# Altium project Digital Interface.PrjPcb (part 2 of 2)

## Sheet Audio Codec.SchDoc
size 297 x 209 mm; SheetNumber: 18; SheetTotal: 29
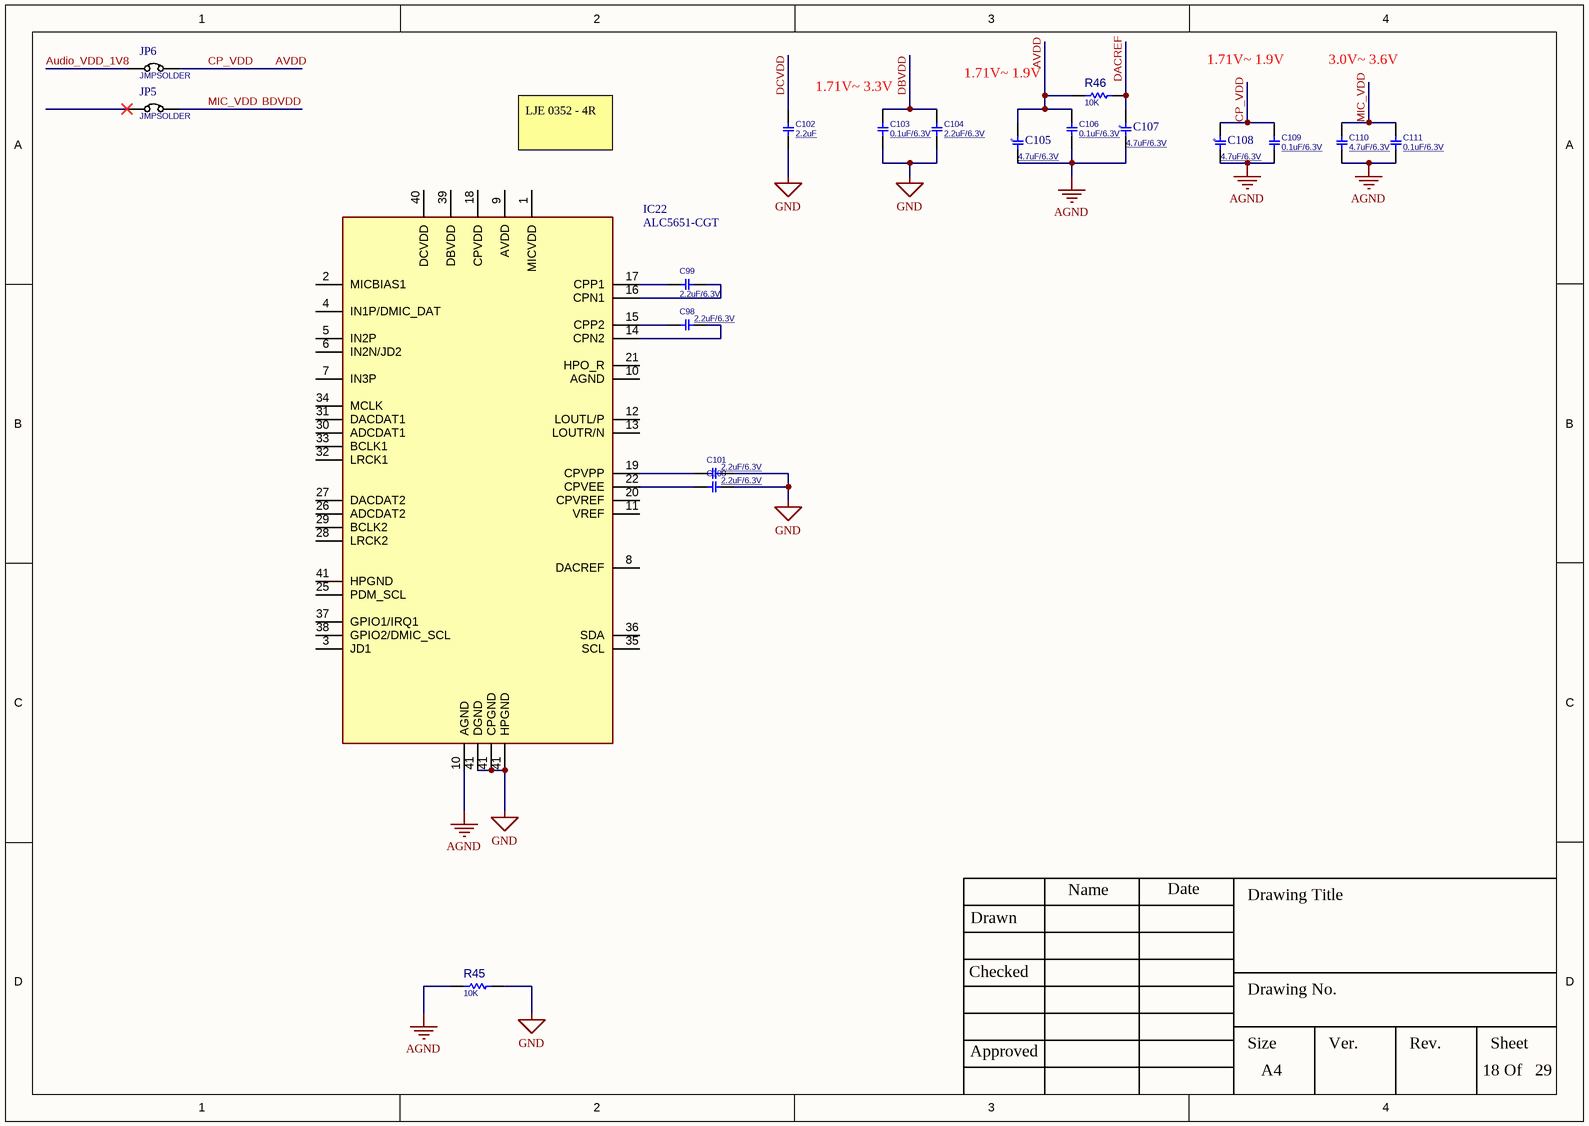
[diagram p15: Audio Codec.SchDoc]

### Parts
C98  2.2uF/6.3V  [C0603]
C99  2.2uF/6.3V  [C0603]
C100  2.2uF/6.3V  [C0603]
C101  2.2uF/6.3V  [C0603]
C102  2.2uF  [C0603]
C103  0.1uF/6.3V  [C0603]
C104  2.2uF/6.3V  [C0603]
C105  value 4.7uF/6.3V  [Cap_A]  (hidden comment: Capacitor Tantalum SMD)
C106  0.1uF/6.3V  [C0603]
C107  value 4.7uF/6.3V  [Cap_A]  (hidden comment: Capacitor Tantalum SMD)
C108  value 4.7uF/6.3V  [Cap_A]  (hidden comment: Capacitor Tantalum SMD)
C109  0.1uF/6.3V  [C0603]
C110  4.7uF/6.3V  [C0805]
C111  0.1uF/6.3V  [C0603]
IC22  ALC5651-CGT  [QFN40P500X500X90-41N-D]
JP5  JMPSOLDER  [JP_40X50]
JP6  JMPSOLDER  [JP_40X50]
R45  10K  [R0603]
R46  10K  [R0603]

### Nets
AGND: C105.1 C106.1 C107.1 C108.1 C109.1 C110.2 C111.2 IC22.10(AGND) R45.1
Audio_VDD_1V8: JP6.1
GND: C100.1 C101.1 C102.1 C103.1 C104.1 IC22.41(HPGND) R45.2
AVDD: C105.2 C106.2 C108.2 C109.2 JP6.2 R46.1  [also labelled CP_VDD]
BDVDD: C110.1 C111.1 JP5.2  [also labelled MIC_VDD]
DACREF: C107.2 R46.2
DBVDD: C103.2 C104.2
DCVDD: C102.2
NetC98_1: C98.1 IC22.14(CPN2)
NetC98_2: C98.2 IC22.15(CPP2)
NetC99_1: C99.1 IC22.17(CPP1)
NetC99_2: C99.2 IC22.16(CPN1)
NetC100_2: C100.2 IC22.22(CPVEE)
NetC101_2: C101.2 IC22.19(CPVPP)

Not connected (* = marked no-connect by the designer): IC22 1(MICVDD) 2(MICBIAS1) 3(JD1) 4(IN1P/DMIC_DAT) 5(IN2P) 6(IN2N/JD2) 7(IN3P) 8(DACREF) 9(AVDD) 11(VREF) 12(LOUTL/P) 13(LOUTR/N) 18(CPVDD) 20(CPVREF) 21(HPO_R) 25(PDM_SCL) 26(ADCDAT2) 27(DACDAT2) 28(LRCK2) 29(BCLK2) 30(ADCDAT1) 31(DACDAT1) 32(LRCK1) 33(BCLK1) 34(MCLK) 35(SCL) 36(SDA) 37(GPIO1/IRQ1) 38(GPIO2/DMIC_SCL) 39(DBVDD) 40(DCVDD); JP5 1*

### Notes on the sheet
- 1.71V~ 1.9V
- 3.0V~ 3.6V
- 1.71V~ 3.3V
- LJE 0352 - 4R
- Drawn
- Name
- Date
- Drawing Title
- Checked
- Drawing No.
- Approved
- Size
- A4
- Ver.
- Rev.
- Sheet
- Of
- (in symbol Capacitor Tantalum SMD) +

### Library data of the parts
C98-C104 C106 C109 C111 = CAP_SMD_MLCC_0603: CAP, MLCC, -F, -V, MATERIAL, -%, 0201; PARAM: -, -%; MANF_P#: MANF_PART#; PRICE: 100= 1$; MANF: -; PARAM2: -V; ASSEMBLY: ASSEMBLY
  C98-C101 C104: VALUE: 2.2uF/6.3V
  C102: VALUE: 2.2uF
  C103 C106 C109 C111: VALUE: 0.1uF/6.3V
C110 = CAP_SMD_MLCC_0805: CAP, MLCC, -F, -V, MATERIAL, -%, 0201; PARAM: -, -%; MANF_P#: MANF_PART#; PRICE: 100= 1$; MANF: -; PARAM2: -V; ASSEMBLY: ASSEMBLY; VALUE: 4.7uF/6.3V
IC22 = ALC5651-CGT: Integrated Circuit; Manufacturer_Name: Realtek; Datasheet Link: https://datasheet.lcsc.com/szlcsc/2001151131_Realtek-Semicon-ALC5651-CGT_C474323.pdf; Height: 0.9mm; Manufacturer_Part_Number: ALC5651-CGT
JP5 JP6 = JUMPER_SOLDER: JUMPER, HEADER 2PIN; MANF: MANF; MANF_P#: MANF_P#; VALUE: JMPSOLDER
R45 R46 = RES_SMD_0603: as R5 on sheet AUX Power; MANF_P#: -; MANF: -; ASSEMBLY: ASSEMBLY; PRICE: 100= 0.5$; VALUE: 10K
C105 C107 C108 = Capacitor Tantalum SMD: DatasheetVersion: 2021; ComponentLink1Description: Website Smart World; ComponentLink1URL: https://www.smartw.ir/; ComponentLink2Description: Telegram; ComponentLink2URL: https://t.me/altium_smartw; ComponentLink3Description: Instagram; ComponentLink3URL: https://Instagram.com/smartgw.ir

## Sheet SD CARD .SchDoc
size 297 x 209 mm; SheetNumber: 19; SheetTotal: 29
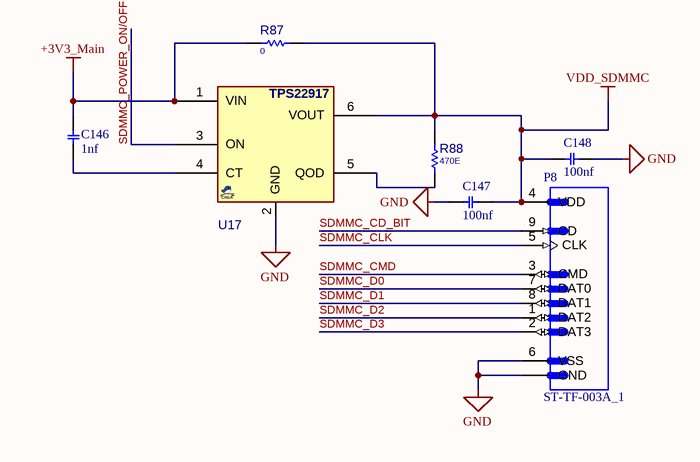
[diagram p16: SD CARD .SchDoc]

### Parts
C146  value 1nf  [C0603]  (hidden comment: Capacitor C SMD 0603)
C147  value 100nf  [C0603]  (hidden comment: Capacitor C SMD 0603)
C148  value 100nf  [C0603]  (hidden comment: Capacitor C SMD 0603)
P8  ST-TF-003A_1  [SUNTECH_ST-TF-003A]
R87  0  [R0603]
R88  470E  [R0603]
U17  TPS22917  [SOT23_6]  (value not drawn)

### Nets
+3V3_Main: C146.2 R87.1 U17.1(VIN)  [project net Audio_VDD_3V3]
GND: C147.2 C148.1 P8.6(VSS) P8.G1(GND) U17.2(GND)
VDD_SDMMC: C147.1 C148.2 P8.4(VDD) R87.2 R88.2 U17.6(VOUT)
SDMMC_CD_BIT: P8.9(CD)
SDMMC_CLK: P8.5(CLK)
SDMMC_CMD: P8.3(CMD)
SDMMC_D0: P8.7(DAT0)
SDMMC_D1: P8.8(DAT1)
SDMMC_D2: P8.1(DAT2)
SDMMC_D3: P8.2(DAT3)
SDMMC_POWER_ON/OFF: U17.3(ON)
NetC146_1: C146.1 U17.4(CT)
NetR88_1: R88.1 U17.5(QOD)

### Notes on the sheet
- Drawn
- Name
- Date
- Drawing Title
- Checked
- Drawing No.
- Approved
- Size
- A4
- Ver.
- Rev.
- Sheet
- Of

### Library data of the parts
P8 = ST-TF-003A_1: Micro SD Card Socket; Price: None; MP: ST-TF-003A; Availability: Unavailable; Value: *; Package: None
R87 R88 = RES_SMD_0603: as R5 on sheet AUX Power; MANF_P#: -; MANF: -; ASSEMBLY: ASSEMBLY; PRICE: 100= 0.5$
  R87: VALUE: 0
  R88: VALUE: 470E
U17 = TPS22917_SOT23: LOAD SW, 2A, 1~5.5v, 80mOhm, SOT23; MANF: TI; MANF_P#: TPS22917DBV; PARAM: 2A, 1~5.5v, 80mOhm, -40~105oC; PRICE: 0.5$; VALUE: TPS22917
C146-C148 = Capacitor C SMD 0603: DatasheetVersion: 2021; ComponentLink1Description: Website Smart World; ComponentLink1URL: https://www.smartw.ir/; ComponentLink2Description: Telegram; ComponentLink2URL: https://t.me/altium_smartw; ComponentLink3Description: Instagram; ComponentLink3URL: https://Instagram.com/smartgw.ir

## Sheet MCU GPIO.SchDoc
size 297 x 209 mm; SheetNumber: 20; SheetTotal: 29
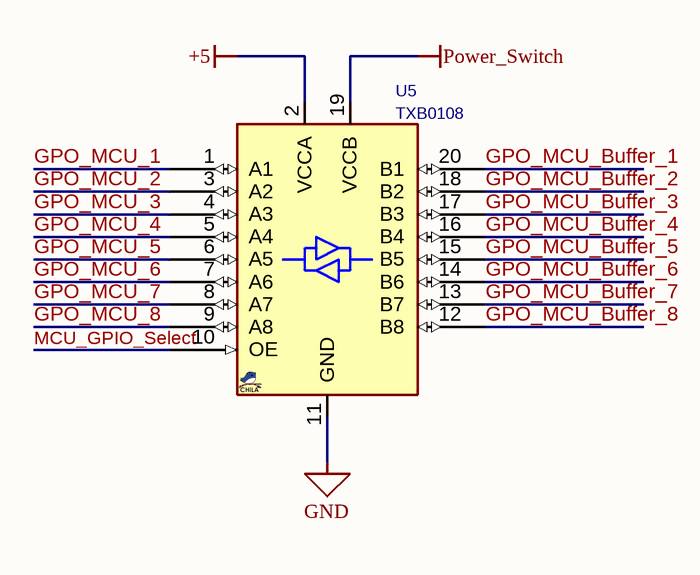
[diagram p17: MCU GPIO.SchDoc]

### Parts
U5  TXB0108  [SOG65_20]

### Nets
+5: U5.2(VCCA)  [project net Current_Measurement_1_in-]
GND: U5.11(GND)
Power_Switch: U5.19(VCCB)
GPO_MCU_1: U5.1(A1)
GPO_MCU_2: U5.3(A2)
GPO_MCU_3: U5.4(A3)
GPO_MCU_4: U5.5(A4)
GPO_MCU_5: U5.6(A5)
GPO_MCU_6: U5.7(A6)
GPO_MCU_7: U5.8(A7)
GPO_MCU_8: U5.9(A8)
GPO_MCU_Buffer_1: U5.20(B1)
GPO_MCU_Buffer_2: U5.18(B2)
GPO_MCU_Buffer_3: U5.17(B3)
GPO_MCU_Buffer_4: U5.16(B4)
GPO_MCU_Buffer_5: U5.15(B5)
GPO_MCU_Buffer_6: U5.14(B6)
GPO_MCU_Buffer_7: U5.13(B7)
GPO_MCU_Buffer_8: U5.12(B8)
MCU_GPIO_Select: U5.10(OE)

### Notes on the sheet
- Drawn
- Name
- Date
- Drawing Title
- Checked
- Drawing No.
- Approved
- Size
- A4
- Ver.
- Rev.
- Sheet
- Of

### Library data of the parts
U5 = TXB0108_TSSOP20: Buffer, VOLTAGE-LEVEL TRANSLATOR, 8-BIT, BIDIRECTIONAL, AUTO-DIRECTION SENSING; MANF: Texas Instruments; DESC: 50mA; MANF_P#: TXB0108PWR; PARAM2: 1.2~3.6VCCA, 1.65~5.5V VCCB (VCCA <= VCCB); PARAM: 8-BIT, BIDIRECTIONAL, AUTO-DIRECTION SENSING; VALUE: TXB0108

## Sheet MCU Sup.SchDoc
size 297 x 209 mm; SheetNumber: 21; SheetTotal: 29
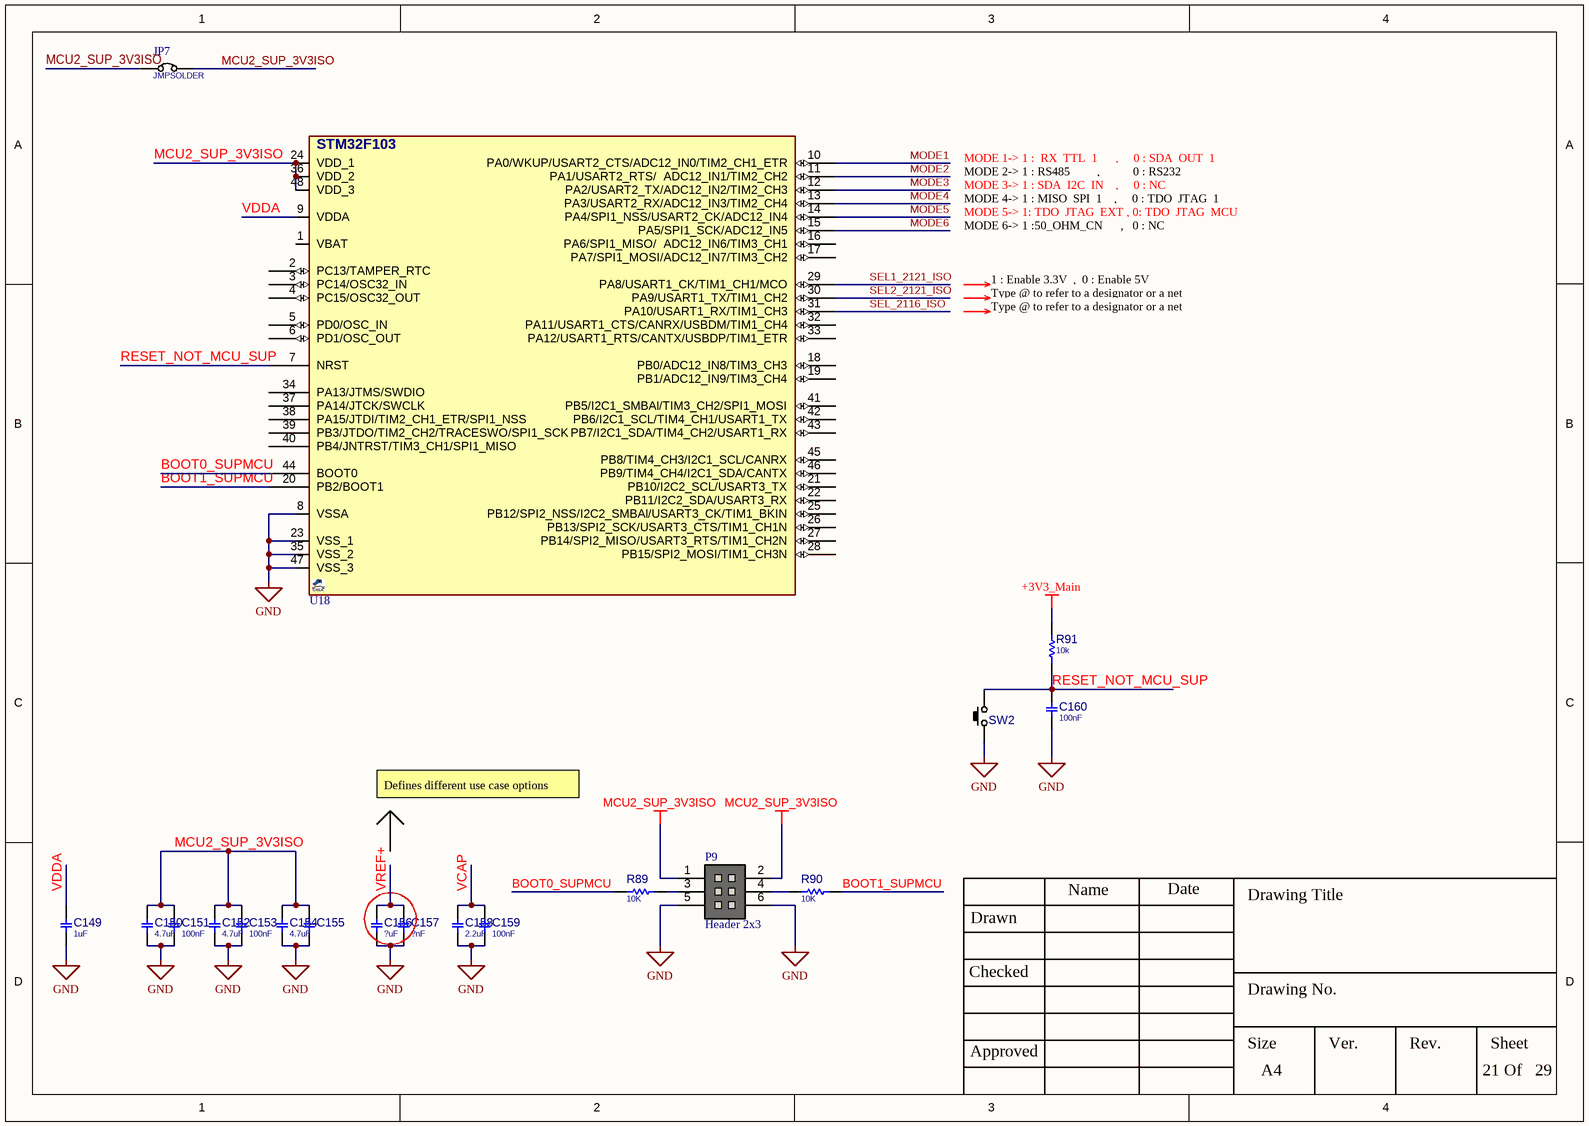
[diagram p18: MCU Sup.SchDoc]

### Parts
C149  1uF  [C0805]
C150  4.7uF  [C0805]
C151  100nF  [C0603]
C152  4.7uF  [C0805]
C153  100nF  [C0603]
C154  4.7uF  [C0805]
C155  (no value)  [C0603]
C156  ?uF  [C0805]
C157  ?nF  [C0603]
C158  2.2uF  [C0805]
C159  100nF  [C0603]
C160  100nF  [C0603]
JP7  JMPSOLDER  [JP_40X50]
P9  Header 2x3  [HDR 2X3]
R89  10K  [R0603]
R90  10K  [R0603]
R91  10k  [R0603]
SW2  PUSHBUTTON  [SWPBS_SPST_6X3X5]  (value not drawn)
U18  STM32F103  [QFG50_48]  (value not drawn)

### Nets
+3V3_Main: R91.2  [project net Audio_VDD_3V3]
GND: C149.2 C150.2 C151.2 C152.2 C153.2 C154.2 C155.2 C156.2 C157.2 C158.2 C159.2 C160.2 P9.5 P9.6 SW2.1(P1) U18.8(VSSA) U18.23(VSS_1) U18.35(VSS_2) U18.47(VSS_3)
MCU2_SUP_3V3ISO: C150.1 C151.1 C152.1 C153.1 C154.1 C155.1 JP7.1 JP7.2 P9.1 P9.2 U18.24(VDD_1) U18.36(VDD_2) U18.48(VDD_3)
BOOT0_SUPMCU: R89.1 U18.44(BOOT0)
BOOT1_SUPMCU: R90.2 U18.20(PB2/BOOT1)
MODE1: U18.10(PA0/WKUP/USART2_CTS/ADC12_IN0/TIM2_CH1_ETR)
MODE2: U18.11(PA1/USART2_RTS/__ADC12_IN1/TIM2_CH2)
MODE3: U18.12(PA2/USART2_TX/ADC12_IN2/TIM2_CH3)
MODE4: U18.13(PA3/USART2_RX/ADC12_IN3/TIM2_CH4)
MODE5: U18.14(PA4/SPI1_NSS/USART2_CK/ADC12_IN4)
MODE6: U18.15(PA5/SPI1_SCK/ADC12_IN5)
RESET_NOT_MCU_SUP: C160.1 R91.1 SW2.2(P3) U18.7(NRST)
SEL1_2121_ISO: U18.29(PA8/USART1_CK/TIM1_CH1/MCO)
SEL2_2121_ISO: U18.30(PA9/USART1_TX/TIM1_CH2)
SEL_2116_ISO: U18.31(PA10/USART1_RX/TIM1_CH3)
VCAP: C158.1 C159.1
VDDA: C149.1 U18.9(VDDA)
VREF+: C156.1 C157.1
NetP9_3: P9.3 R89.2
NetP9_4: P9.4 R90.1

Not connected (* = marked no-connect by the designer): U18 1(VBAT) 2(PC13/TAMPER_RTC) 3(PC14/OSC32_IN) 4(PC15/OSC32_OUT) 5(PD0/OSC_IN) 6(PD1/OSC_OUT) 16(PA6/SPI1_MISO/__ADC12_IN6/TIM3_CH1) 17(PA7/SPI1_MOSI/ADC12_IN7/TIM3_CH2) 18(PB0/ADC12_IN8/TIM3_CH3) 19(PB1/ADC12_IN9/TIM3_CH4) 21(PB10/I2C2_SCL/USART3_TX) 22(PB11/I2C2_SDA/USART3_RX) 25(PB12/SPI2_NSS/I2C2_SMBAl/USART3_CK/TIM1_BKIN) 26(PB13/SPI2_SCK/USART3_CTS/TIM1_CH1N) 27(PB14/SPI2_MISO/USART3_RTS/TIM1_CH2N) 28(PB15/SPI2_MOSI/TIM1_CH3N) 32(PA11/USART1_CTS/CANRX/USBDM/TIM1_CH4) 33(PA12/USART1_RTS/CANTX/USBDP/TIM1_ETR) 34(PA13/JTMS/SWDIO) 37(PA14/JTCK/SWCLK) 38(PA15/JTDI/TIM2_CH1_ETR/SPI1_NSS) 39(PB3/JTDO/TIM2_CH2/TRACESWO/SPI1_SCK) 40(PB4/JNTRST/TIM3_CH1/SPI1_MISO) 41(PB5/I2C1_SMBAl/TIM3_CH2/SPI1_MOSI) 42(PB6/I2C1_SCL/TIM4_CH1/USART1_TX) 43(PB7/I2C1_SDA/TIM4_CH2/USART1_RX) 45(PB8/TIM4_CH3/I2C1_SCL/CANRX) 46(PB9/TIM4_CH4/I2C1_SDA/CANTX)

### Notes on the sheet
- MODE 1-> 1 :  RX_TTL_1      ,     0 : SDA_OUT_1
- MODE 2-> 1 : RS485         ,           0 : RS232
- MODE 3-> 1 : SDA_I2C_IN    ,     0 : NC
- MODE 4-> 1 : MISO_SPI_1    ,     0 : TDO_JTAG_1
- MODE 5-> 1: TDO_JTAG_EXT , 0: TDO_JTAG_MCU
- MODE 6-> 1 :50_OHM_CN      ,   0 : NC
- 1 : Enable 3.3V  ,  0 : Enable 5V
- Type @ to refer to a designator or a net
- Defines different use case options
- Drawn
- Name
- Date
- Drawing Title
- Checked
- Drawing No.
- Approved
- Size
- A4
- Ver.
- Rev.
- Sheet
- Of

### Library data of the parts
C149 C150 C152 C154 C156 C158 = CAP_SMD_MLCC_2.2u50V_0805: CAP, MLCC; MANF_P#: UMK212ABJ225KG-T; MANF: Taiyo Yuden; PARAM: X5R, 10%; DIST#: MOUSER; PARAM2: 50V; ASSEMBLY: ASSEMBLY; PRICE: 100= 10$; DESC: CAP, MLCC
  C149: VALUE: 1uF
  C150 C152 C154: VALUE: 4.7uF
  C156: VALUE: ?uF
  C158: VALUE: 2.2uF
C151 C153 C155 C157 C159 C160 = CAP_SMD_MLCC_2.2u50V_0603: CAP, MLCC; MANF_P#: C1005X7R1H104K050BB; MANF: TDK; PARAM: X7R, 10%; DIST#: MOUSER; PARAM2: 50V; ASSEMBLY: ASSEMBLY; PRICE: 1000= 27$; DESC: CAP, MLCC
  C151 C153 C159 C160: VALUE: 100nF
  C157: VALUE: ?nF
JP7 = JUMPER_SOLDER: JUMPER, HEADER 2PIN; MANF: MANF; MANF_P#: MANF_P#; VALUE: JMPSOLDER
R89 R90 = RES_SMD: RESISTOR, SMD; PARAM: -W; DESC: DESCRIPTION; DIST#: MOUSER; PARAM2: 1%; MANF_P#: -; MANF: -; ASSEMBLY: ASSEMBLY; PRICE: 100= 0.5$; VALUE: 10K
R91 = RES_SMD_0603: as R5 on sheet AUX Power; MANF_P#: -; MANF: -; ASSEMBLY: ASSEMBLY; PRICE: 100= 0.5$; VALUE: 10k
SW2 = SWPBS_SPST_6X3X5: SWITCH, PUSH BUTTON, TACTILE, SMD, SPST, 6X3.5X5mm; MANF: ALPS; DESC: DESCRIPTION; MANF_P#: SKQMBBE010; VALUE: PUSHBUTTON; ASSEMBLY: ASSEMBLY; PARAM: PARAM; PRICE: PRICE
U18 = STM32F103C8T6_QFP48: MCU, STM32 ARM 32-bit, Cortex M3, 64KB FLASH, 20KB SRAM; DESC: CAN, I2C, SPI, USART, USB; MANF: ST; PARAM2: 2~3.6VCC, 72MHz, 2X12Bit ADC; PARAM: 64KB FLASH, 20KB SRAM, -40~85oC; MANF_P#: STM32F103C8T6; PRICE: 6$; VALUE: STM32F103
P9 = Header 2x3: ComponentLinkp-URL: https://www.smartw.ir/; DatasheetVersion: 2020

## Sheet Sync In.SchDoc
size 297 x 209 mm; SheetNumber: 22; SheetTotal: 29
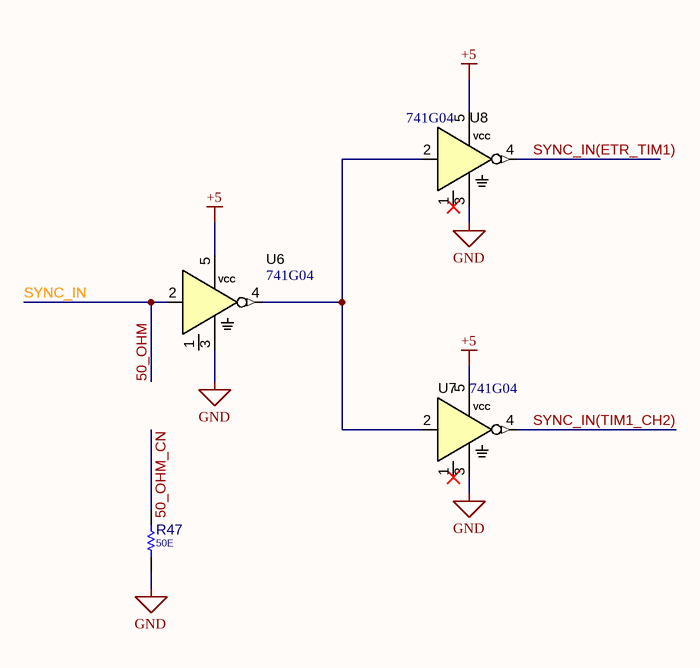
[diagram p19: Sync In.SchDoc]

### Parts
R47  50E  [R0603]
U6  741G04  [SOT353_5]
U7  741G04  [SOT353_5]
U8  741G04  [SOT353_5]

### Nets
+5: U6.5(VCC) U7.5(VCC) U8.5(VCC)  [project net Current_Measurement_1_in-]
GND: R47.2 U6.3(GND) U7.3(GND) U8.3(GND)
50_OHM: U6.2(A)  [also labelled SYNC_IN]
50_OHM_CN: R47.1
SYNC_IN(ETR_TIM1): U8.4(Y)
SYNC_IN(TIM1_CH2): U7.4(Y)
NetU6_4: U6.4(Y) U7.2(A) U8.2(A)

Not connected (* = marked no-connect by the designer): U6 1(NC); U7 1(NC)*; U8 1(NC)*

### Notes on the sheet
- Drawn
- Name
- Date
- Drawing Title
- Checked
- Drawing No.
- Approved
- Size
- A4
- Ver.
- Rev.
- Sheet
- Of

### Library data of the parts
R47 = RES_SMD_0603: as R5 on sheet AUX Power; MANF_P#: -; MANF: -; ASSEMBLY: ASSEMBLY; PRICE: 100= 0.5$; VALUE: 50E
U6-U8 = NOT_SN74LVC1G04_SOT353: GATE, NOT, SINGLE, SOT353 SMD; MANF: Texas Instruments; MANF_P#: SN74LVC1GU04DCK; PARAM2: 2~5.5V; VALUE: 741G04

## Sheet Sync Out.SchDoc
size 297 x 209 mm; SheetNumber: 23; SheetTotal: 29
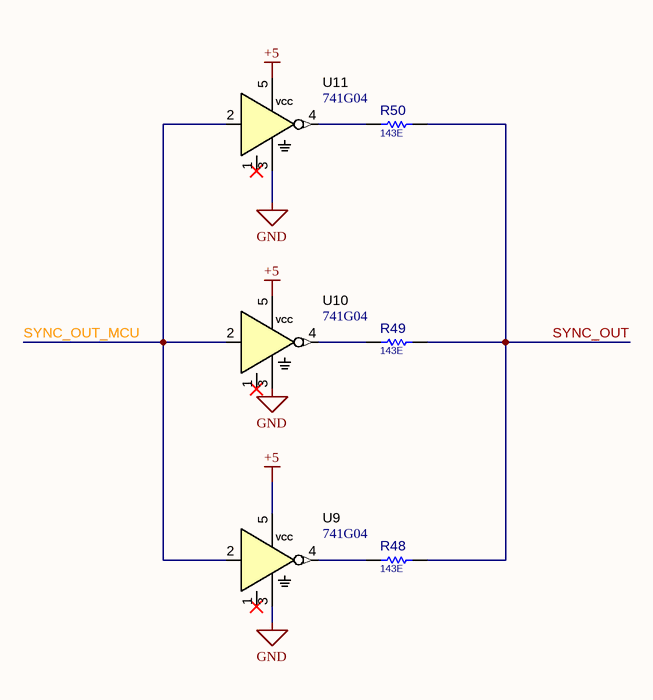
[diagram p20: Sync Out.SchDoc]

### Parts
R48  143E  [R0603]
R49  143E  [R0603]
R50  143E  [R0603]
U9  741G04  [SOT353_5]
U10  741G04  [SOT353_5]
U11  741G04  [SOT353_5]

### Nets
+5: U9.5(VCC) U10.5(VCC) U11.5(VCC)  [project net Current_Measurement_1_in-]
GND: U9.3(GND) U10.3(GND) U11.3(GND)
SYNC_OUT: R48.2 R49.2 R50.2
SYNC_OUT_MCU: U9.2(A) U10.2(A) U11.2(A)
NetR48_1: R48.1 U9.4(Y)
NetR49_1: R49.1 U10.4(Y)
NetR50_1: R50.1 U11.4(Y)

Not connected (* = marked no-connect by the designer): U9 1(NC)*; U10 1(NC)*; U11 1(NC)*

### Notes on the sheet
- Drawn
- Name
- Date
- Drawing Title
- Checked
- Drawing No.
- Approved
- Size
- A4
- Ver.
- Rev.
- Sheet
- Of

### Library data of the parts
R48-R50 = RES_SMD_0603: as R5 on sheet AUX Power; MANF_P#: -; MANF: -; ASSEMBLY: ASSEMBLY; PRICE: 100= 0.5$; VALUE: 143E
U9-U11 = NOT_SN74LVC1G04_SOT353: as U6 on sheet Sync In; VALUE: 741G04

## Sheet Iso Power Protection.SchDoc
size 297 x 209 mm; SheetNumber: 26; SheetTotal: 32

### Notes on the sheet
- Drawn
- Name
- Date
- Drawing Title
- Checked
- Drawing No.
- Approved
- Size
- A4
- Ver.
- Rev.
- Sheet
- Of

## Sheet FT2232HL_IN.SchDoc
size 297 x 209 mm; SheetNumber: 25; SheetTotal: 29
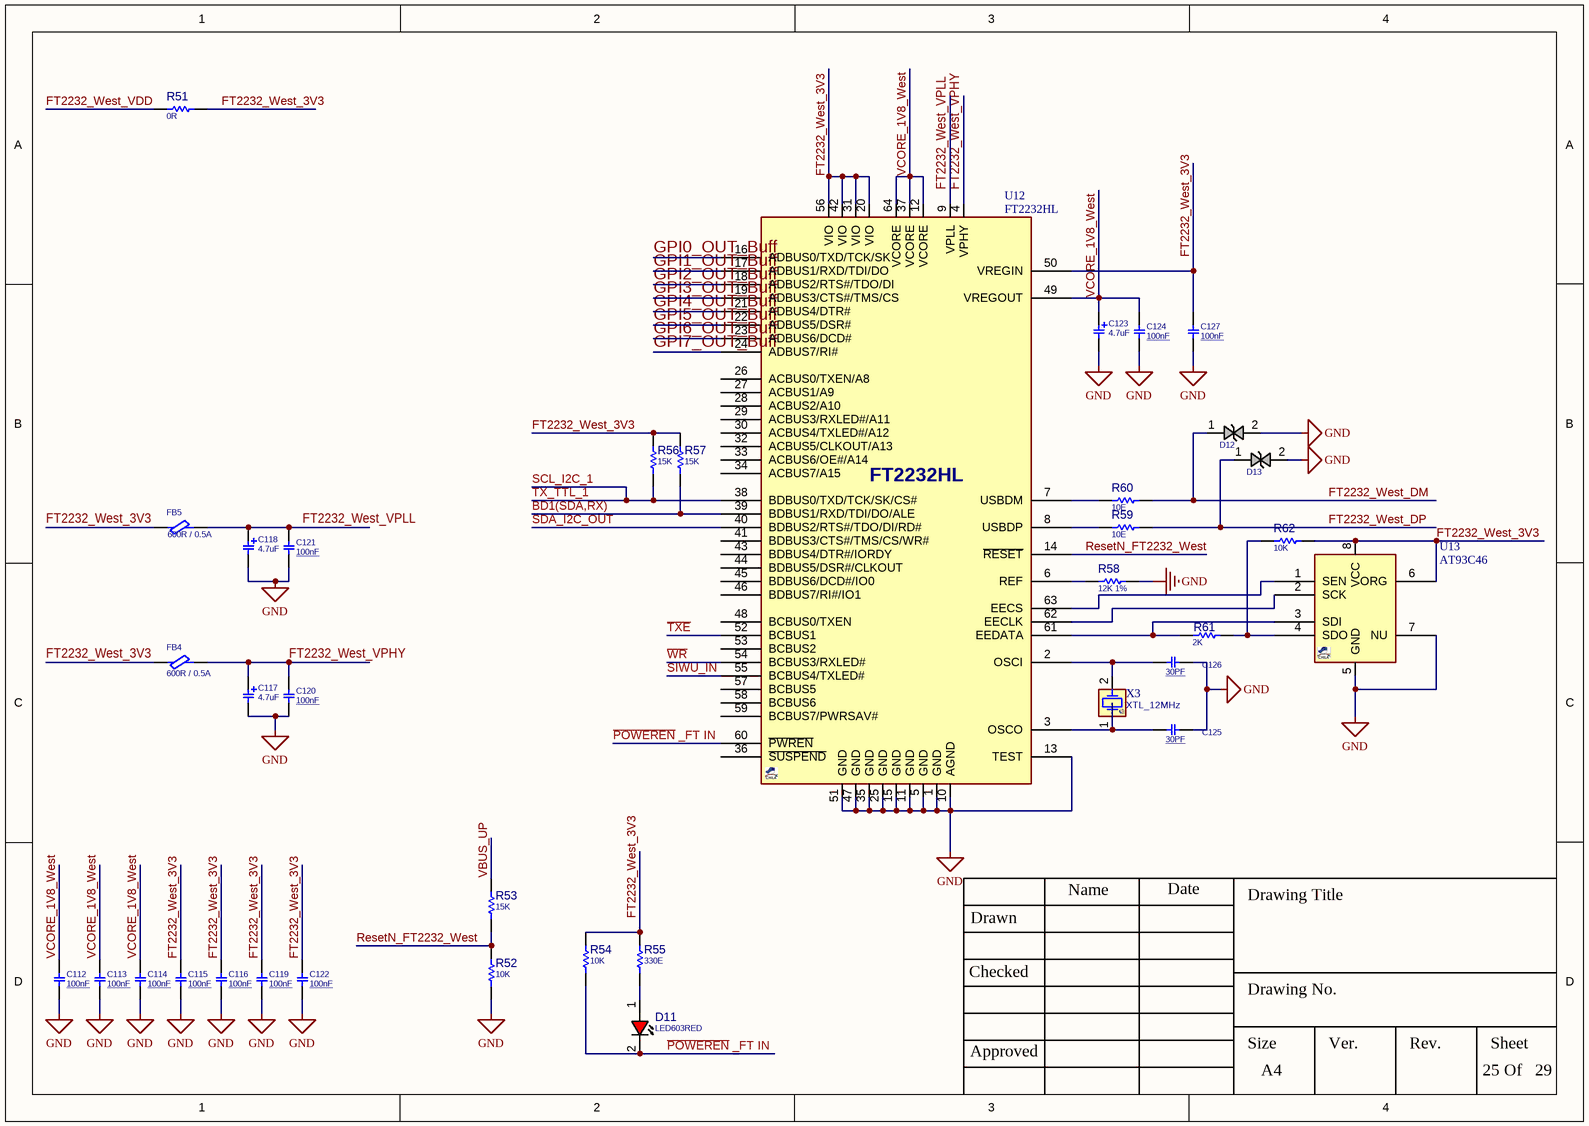
[diagram p21: FT2232HL_IN.SchDoc]

### Parts
C112  100nF  [0603]
C113  100nF  [0603]
C114  100nF  [0603]
C115  100nF  [0603]
C116  100nF  [0603]
C117  4.7uF  [C_TN_3216]
C118  4.7uF  [C_TN_3216]
C119  100nF  [0603]
C120  100nF  [0603]
C121  100nF  [0603]
C122  100nF  [0603]
C123  4.7uF  [C_TN_3216]
C124  100nF  [0603]
C125  30PF  [C0805]
C126  30PF  [C0805]
C127  100nF  [0603]
D11  LED603RED  [LED0603RED]
D12  TVS603  [D0603]  (value not drawn)
D13  TVS603  [D0603]  (value not drawn)
FB4  600R / 0.5A  [L0603]
FB5  600R / 0.5A  [L0603]
R51  0R  [R0603]
R52  10K  [R0603]
R53  15K  [R0603]
R54  10K  [R0603]
R55  330E  [R0603]
R56  15K  [R0603]
R57  15K  [R0603]
R58  value 12K 1%  [R025W_AX04]  (hidden comment: 12K)
R59  10E  [R0603]
R60  10E  [R0603]
R61  value 2K  [R025W_AX04]  (hidden comment: 12K)
R62  value 10K  [R025W_AX04]  (hidden comment: 12K)
U12  FT2232HL  [QFG50_64]
U13  AT93C46  [SO_8]
X3  XTL_12MHz  [XTL_2_11X5]

### Nets
FT2232_West_VDD: R51.1  [project net Audio_VDD_3V3]
GND: C112.2 C113.2 C114.2 C115.2 C116.2 C117.2 C118.2 C119.2 C120.2 C121.2 C122.2 C123.2 C124.2 C125.2 C126.2 C127.2 D12.2 D13.2 R52.2 R58.1 U12.1(GND) U12.5(GND) U12.10(AGND) U12.11(GND) U12.13(TEST) U12.15(GND) U12.25(GND) U12.35(GND) U12.47(GND) U12.51(GND) U13.5(GND) U13.7(NU)
~{POWEREN} _FT IN: D11.2(CATHODE) R54.2 U12.60(~{PWREN})
BD1(SDA,RX): R57.2 U12.39(BDBUS1/RXD/TDI/DO/ALE)
FT2232_West_3V3: C115.1 C116.1 C119.1 C122.1 C127.1 FB4.1 FB5.1 R51.2 R54.1 R55.1 R56.1 R57.1 R62.1 U12.20(VIO) U12.31(VIO) U12.42(VIO) U12.50(VREGIN) U12.56(VIO) U13.6(ORG) U13.8(VCC)
FT2232_West_DM: D12.1 R60.1
FT2232_West_DP: D13.1 R59.1
FT2232_West_VPHY: C117.1 C120.1 FB4.2 U12.4(VPHY)
FT2232_West_VPLL: C118.1 C121.1 FB5.2 U12.9(VPLL)
GPI0_OUT_Buff: U12.16(ADBUS0/TXD/TCK/SK)
GPI1_OUT_Buff: U12.17(ADBUS1/RXD/TDI/DO)
GPI2_OUT_Buff: U12.18(ADBUS2/RTS#/TDO/DI)
GPI3_OUT_Buff: U12.19(ADBUS3/CTS#/TMS/CS)
GPI4_OUT_Buff: U12.21(ADBUS4/DTR#)
GPI5_OUT_Buff: U12.22(ADBUS5/DSR#)
GPI6_OUT_Buff: U12.23(ADBUS6/DCD#)
GPI7_OUT_Buff: U12.24(ADBUS7/RI#)
ResetN_FT2232_West: R52.1 R53.2 U12.14(~{RESET})
SCL_I2C_1: R56.2 U12.38(BDBUS0/TXD/TCK/SK/CS#)  [also labelled TX_TTL_1]
SDA_I2C_OUT: U12.40(BDBUS2/RTS#/TDO/DI/RD#)
SIWU_IN: U12.55(BCBUS4/TXLED#)
~{TXE}: U12.52(BCBUS1)
VBUS_UP: R53.1
VCORE_1V8_West: C112.1 C113.1 C114.1 C123.1 C124.1 U12.12(VCORE) U12.37(VCORE) U12.49(VREGOUT) U12.64(VCORE)
~{WR}: U12.54(BCBUS3/RXLED#)
NetC125_1: C125.1 U12.3(OSCO) X3.1(OSC1)
NetC126_1: C126.1 U12.2(OSCI) X3.2(OSC2)
NetD11_1: D11.1(ANODE) R55.2
NetR58_2: R58.2 U12.6(REF)
NetR59_2: R59.2 U12.8(USBDP)
NetR60_2: R60.2 U12.7(USBDM)
NetR61_1: R61.1 R62.2 U13.4(SDO)
NetR61_2: R61.2 U12.61(EEDATA) U13.3(SDI)
NetU12_62: U12.62(EECLK) U13.2(SCK)
NetU12_63: U12.63(EECS) U13.1(SEN)

Not connected (* = marked no-connect by the designer): U12 26(ACBUS0/TXEN/A8) 27(ACBUS1/A9) 28(ACBUS2/A10) 29(ACBUS3/RXLED#/A11) 30(ACBUS4/TXLED#/A12) 32(ACBUS5/CLKOUT/A13) 33(ACBUS6/OE#/A14) 34(ACBUS7/A15) 36(~{SUSPEND}) 41(BDBUS3/CTS#/TMS/CS/WR#) 43(BDBUS4/DTR#/IORDY) 44(BDBUS5/DSR#/CLKOUT) 45(BDBUS6/DCD#/IO0) 46(BDBUS7/RI#/IO1) 48(BCBUS0/TXEN) 53(BCBUS2) 57(BCBUS5) 58(BCBUS6) 59(BCBUS7/PWRSAV#)

### Notes on the sheet
- Drawn
- Name
- Date
- Drawing Title
- Checked
- Drawing No.
- Approved
- Size
- A4
- Ver.
- Rev.
- Sheet
- Of

### Library data of the parts
C112-C116 C119-C122 C124 C127 = CAP_SMD_FILM_1u16v_1210: as C19 on sheet AUX Power; PRICE: 100= 36$; DESC: -; PARAM2: 16V; ASSEMBLY: ASSEMBLY; VALUE: 100nF
C117 C118 C123 = CAP_SMD_TAN_10uF_6.3V: as C76 on sheet RS232; PRICE: 0.46$; VALUE: 4.7uF
C125 C126 = CAP_SMD_MLCC: as C66 on sheet USB HUB; PARAM: C0G, 10%; PRICE: 100= 1.4$; DESC: -; MANF_P#: -; PARAM2: 50V; ASSEMBLY: ASSEMBLY; VALUE: 30PF
D11 = LED_SMD_0603_RED: as D9 on sheet AUX Power; MANF: MANF; ASSEMBLY: ASSEMBLY; PRICE: PRICE; VALUE: LED603RED
D12 D13 = TVS_PGB0010603MR: TVS, ESD PROTECT, 24VDC, Bidirectional; MANF: LittelFuse; MANF_P#: PGB0010603MR; VALUE: TVS603
FB4 FB5 = FBEAD_SMD_MPZ1608S102: FERRITE_Bead, 0603, 0.8A, 300mOhm, 1000@100MHz; MANF: TDK; MANF_P#: MPZ1608S102ATA00; PARAM: 1000@100MHz; PARAM2: 0.8A; PRICE: 100= 3.4$; VALUE: 600R / 0.5A
R51-R57 R59 R60 = RES_SMD_0603: as R5 on sheet AUX Power; MANF_P#: -; MANF: -; ASSEMBLY: ASSEMBLY; PRICE: 100= 0.5$
  R51: VALUE: 0R
  R52 R54: VALUE: 10K
  R53 R56 R57: VALUE: 15K
  R55: VALUE: 330E
  R59 R60: VALUE: 10E
R58 R61 R62 = RES_THD: RESISTOR, THD; MANF_P#: RK73H1ETTP4701F; MANF: KOA SPEER; PARAM: 0.063W; DESC: DESCRIPTION; DIST#: MOUSER; PARAM2: 1%; ASSEMBLY: ASSEMBLY; PRICE: 100= 0.5$
U12 = FT2232HL_QFP64: USB, DUAL, Multipurpose UART/FIFO, USB High Speed; MANF: FTDI; PARAM2: 3.3V; MANF_P#: FT2232HL; VALUE: FT2232HL
U13 = EEPROM_SPI_AT93C46_SOP8: EEPROM, SPI, 1KBIT, SOP-8; VALUE: AT93C46
X3 = XTL_2_HC49_8MHz_SMD: as X2 on sheet USB HUB; PRICE: 0.3$; VALUE: XTL_12MHz

## Sheet FT2232HL_OUT.SchDoc
size 297 x 209 mm; SheetNumber: 26; SheetTotal: 29
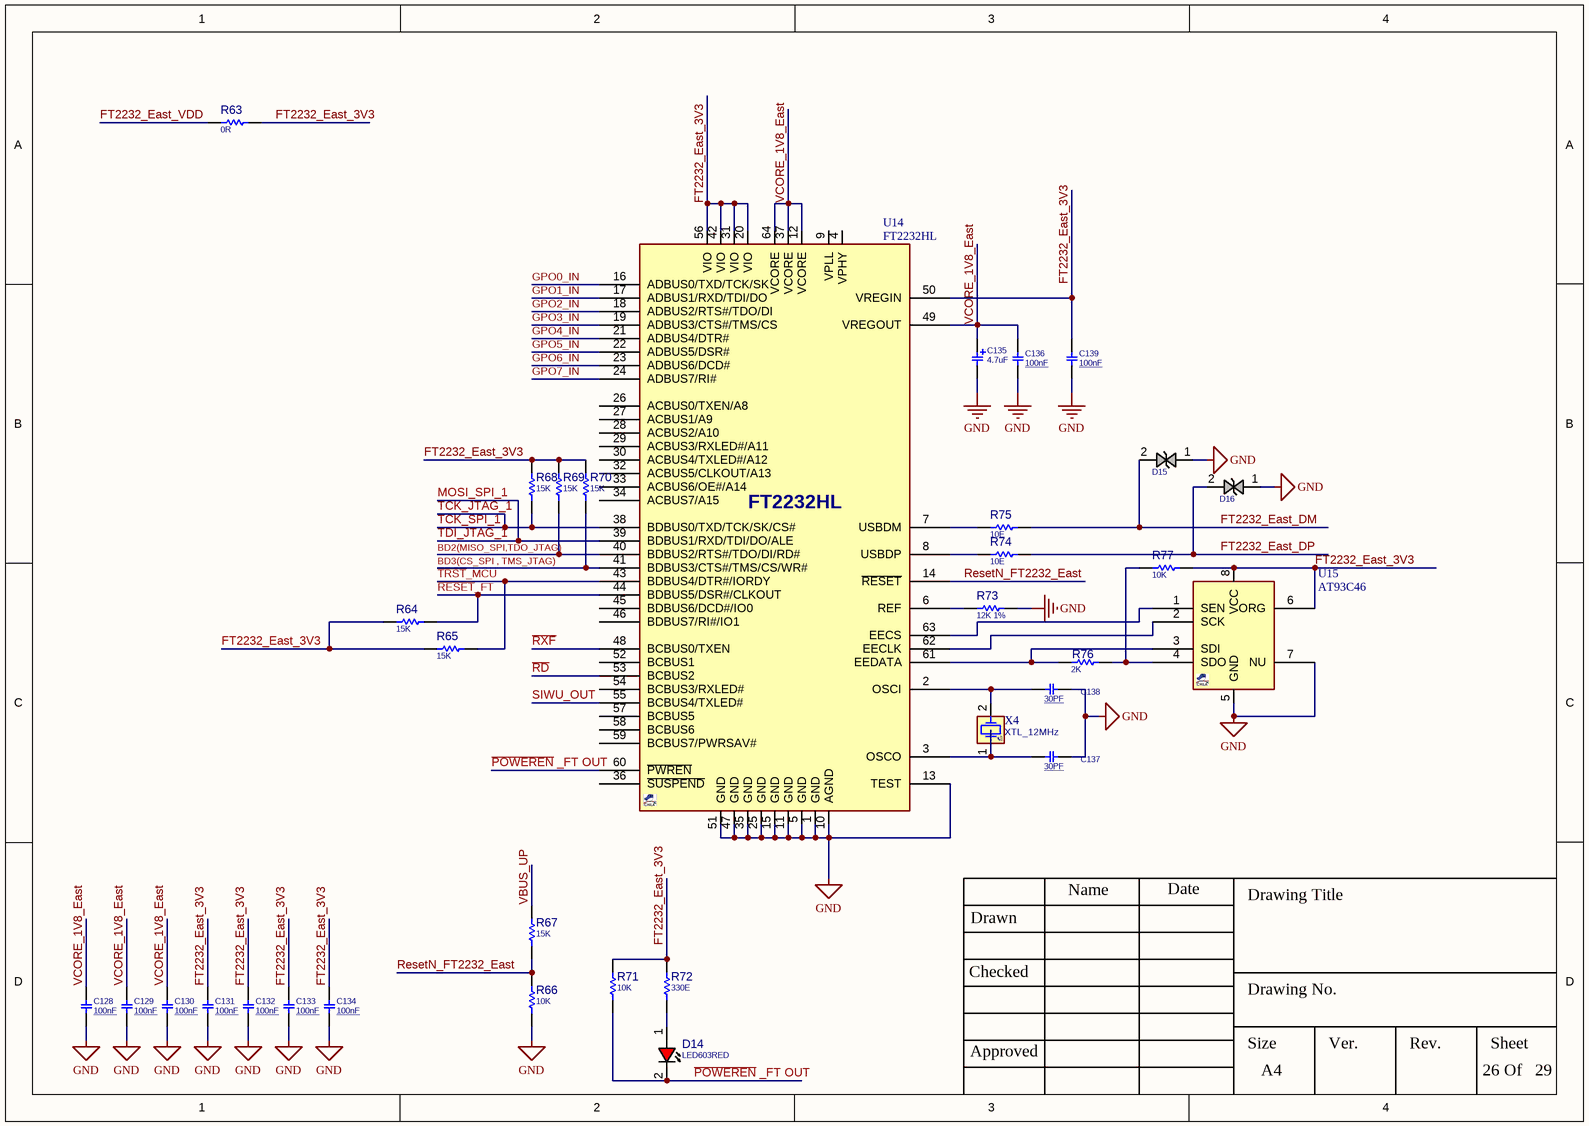
[diagram p22: FT2232HL_OUT.SchDoc]

### Parts
C128  100nF  [0603]
C129  100nF  [0603]
C130  100nF  [0603]
C131  100nF  [0603]
C132  100nF  [0603]
C133  100nF  [0603]
C134  100nF  [0603]
C135  4.7uF  [C_TN_3216]
C136  100nF  [0603]
C137  30PF  [C0805]
C138  30PF  [C0805]
C139  100nF  [0603]
D14  LED603RED  [LED0603RED]
D15  TVS603  [D0603]  (value not drawn)
D16  TVS603  [D0603]  (value not drawn)
R63  0R  [R0603]
R64  15K  [R0603]
R65  15K  [R0603]
R66  10K  [R0603]
R67  15K  [R0603]
R68  15K  [R0603]
R69  15K  [R0603]
R70  15K  [R0603]
R71  10K  [R0603]
R72  330E  [R0603]
R73  value 12K 1%  [R025W_AX04]  (hidden comment: 12K)
R74  10E  [R0603]
R75  10E  [R0603]
R76  value 2K  [R025W_AX04]  (hidden comment: 12K)
R77  value 10K  [R025W_AX04]  (hidden comment: 12K)
U14  FT2232HL  [QFG50_64]
U15  AT93C46  [SO_8]
X4  XTL_12MHz  [XTL_2_11X5]

### Nets
FT2232_East_VDD: R63.1  [project net Audio_VDD_3V3]
GND: C128.2 C129.2 C130.2 C131.2 C132.2 C133.2 C134.2 C135.2 C136.2 C137.2 C138.2 C139.2 D15.1 D16.1 R66.2 R73.1 U14.1(GND) U14.5(GND) U14.10(AGND) U14.11(GND) U14.13(TEST) U14.15(GND) U14.25(GND) U14.35(GND) U14.47(GND) U14.51(GND) U15.5(GND) U15.7(NU)
~{POWEREN} _FT OUT: D14.2(CATHODE) R71.2 U14.60(~{PWREN})
BD2(MISO_SPI,TDO_JTAG): R69.2 U14.40(BDBUS2/RTS#/TDO/DI/RD#)
BD3(CS_SPI , TMS_JTAG): R70.2 U14.41(BDBUS3/CTS#/TMS/CS/WR#)
FT2232_East_3V3: C131.1 C132.1 C133.1 C134.1 C139.1 R63.2 R64.1 R65.1 R68.1 R69.1 R70.1 R71.1 R72.1 R77.1 U14.20(VIO) U14.31(VIO) U14.42(VIO) U14.50(VREGIN) U14.56(VIO) U15.6(ORG) U15.8(VCC)
FT2232_East_DM: D15.2 R75.1
FT2232_East_DP: D16.2 R74.1
GPO0_IN: U14.16(ADBUS0/TXD/TCK/SK)
GPO1_IN: U14.17(ADBUS1/RXD/TDI/DO)
GPO2_IN: U14.18(ADBUS2/RTS#/TDO/DI)
GPO3_IN: U14.19(ADBUS3/CTS#/TMS/CS)
GPO4_IN: U14.21(ADBUS4/DTR#)
GPO5_IN: U14.22(ADBUS5/DSR#)
GPO6_IN: U14.23(ADBUS6/DCD#)
GPO7_IN: U14.24(ADBUS7/RI#)
MOSI_SPI_1: U14.39(BDBUS1/RXD/TDI/DO/ALE)  [also labelled TDI_JTAG_1]
~{RD}: U14.53(BCBUS2)
~{RESET}_FT: R64.2 U14.44(BDBUS5/DSR#/CLKOUT)
~{RXF}: U14.48(BCBUS0/TXEN)
ResetN_FT2232_East: R66.1 R67.2 U14.14(~{RESET})
SIWU_OUT: U14.55(BCBUS4/TXLED#)
~{TRST}_MCU: R65.2 U14.43(BDBUS4/DTR#/IORDY)
TCK_JTAG_1: R68.2 U14.38(BDBUS0/TXD/TCK/SK/CS#)  [also labelled TCK_SPI_1]
VBUS_UP: R67.1
VCORE_1V8_East: C128.1 C129.1 C130.1 C135.1 C136.1 U14.12(VCORE) U14.37(VCORE) U14.49(VREGOUT) U14.64(VCORE)
NetC137_1: C137.1 U14.3(OSCO) X4.1(OSC1)
NetC138_1: C138.1 U14.2(OSCI) X4.2(OSC2)
NetD14_1: D14.1(ANODE) R72.2
NetR73_2: R73.2 U14.6(REF)
NetR74_2: R74.2 U14.8(USBDP)
NetR75_2: R75.2 U14.7(USBDM)
NetR76_1: R76.1 R77.2 U15.4(SDO)
NetR76_2: R76.2 U14.61(EEDATA) U15.3(SDI)
NetU14_62: U14.62(EECLK) U15.2(SCK)
NetU14_63: U14.63(EECS) U15.1(SEN)

Not connected (* = marked no-connect by the designer): U14 4(VPHY) 9(VPLL) 26(ACBUS0/TXEN/A8) 27(ACBUS1/A9) 28(ACBUS2/A10) 29(ACBUS3/RXLED#/A11) 30(ACBUS4/TXLED#/A12) 32(ACBUS5/CLKOUT/A13) 33(ACBUS6/OE#/A14) 34(ACBUS7/A15) 36(~{SUSPEND}) 45(BDBUS6/DCD#/IO0) 46(BDBUS7/RI#/IO1) 52(BCBUS1) 54(BCBUS3/RXLED#) 57(BCBUS5) 58(BCBUS6) 59(BCBUS7/PWRSAV#)

### Notes on the sheet
- Drawn
- Name
- Date
- Drawing Title
- Checked
- Drawing No.
- Approved
- Size
- A4
- Ver.
- Rev.
- Sheet
- Of

### Library data of the parts
C128-C134 C136 C139 = CAP_SMD_FILM_1u16v_1210: CAP, FILM, 1uF, 16V, Acryl, 20%, 1210; PARAM: Acrylic, MetallizedStacked, 20%, -40~85oC; MANF_P#: ECP-U1C105MA5; MANF: Panasonic; PRICE: 100= 36$; DESC: -; PARAM2: 16V; ASSEMBLY: ASSEMBLY; VALUE: 100nF
C135 = CAP_SMD_TAN_10uF_6.3V: CAP, SMD, TAN; PARAM: 20%, 300mOhm, -55~105oC; MANF: VISHAY; MANF_P#: T55A106M6R3C0300; PARAM2: 6.3V; PRICE: 0.46$; VALUE: 4.7uF
C137 C138 = CAP_SMD_MLCC: CAP, MLCC, 1nF, 50V, C0G, 10%, 0402; MANF: Murata; PARAM: C0G, 10%; PRICE: 100= 1.4$; DESC: -; MANF_P#: -; PARAM2: 50V; ASSEMBLY: ASSEMBLY; VALUE: 30PF
D14 = LED_SMD_0603_RED: LED, SMD, 0603, RED; PARAM: 30mA, 640nm; DESC: DESCRIPTION; MANF_P#: MANF_PART#; PARAM2: 1.8~2.5V; MANF: MANF; ASSEMBLY: ASSEMBLY; PRICE: PRICE; VALUE: LED603RED
D15 D16 = TVS_PGB0010603MR: TVS, ESD PROTECT, 24VDC, Bidirectional; MANF: LittelFuse; MANF_P#: PGB0010603MR; VALUE: TVS603
R63-R72 R74 R75 = RES_SMD_0603: RESISTOR, SMD; PARAM: -W; DESC: DESCRIPTION; DIST#: MOUSER; PARAM2: 1%; MANF_P#: -; MANF: -; ASSEMBLY: ASSEMBLY; PRICE: 100= 0.5$
  R63: VALUE: 0R
  R64 R65 R67-R70: VALUE: 15K
  R66 R71: VALUE: 10K
  R72: VALUE: 330E
  R74 R75: VALUE: 10E
R73 R76 R77 = RES_THD: RESISTOR, THD; MANF_P#: RK73H1ETTP4701F; MANF: KOA SPEER; PARAM: 0.063W; DESC: DESCRIPTION; DIST#: MOUSER; PARAM2: 1%; ASSEMBLY: ASSEMBLY; PRICE: 100= 0.5$
U14 = FT2232HL_QFP64: USB, DUAL, Multipurpose UART/FIFO, USB High Speed; MANF: FTDI; PARAM2: 3.3V; MANF_P#: FT2232HL; VALUE: FT2232HL
U15 = EEPROM_SPI_AT93C46_SOP8: EEPROM, SPI, 1KBIT, SOP-8; VALUE: AT93C46
X4 = XTL_2_HC49_8MHz_SMD: Crystal MOST POPULAR ABL HC49 PACKAGE; MANF: ABRACON; MANF_P#: ABLS-8.000MHZ-B4-T; PARAM: 8MHz, 18pF, 30PPM, -20~70oC; PRICE: 0.3$; VALUE: XTL_12MHz

## Sheet USB_TTL.SchDoc
size 297 x 209 mm; SheetNumber: 27; SheetTotal: 29
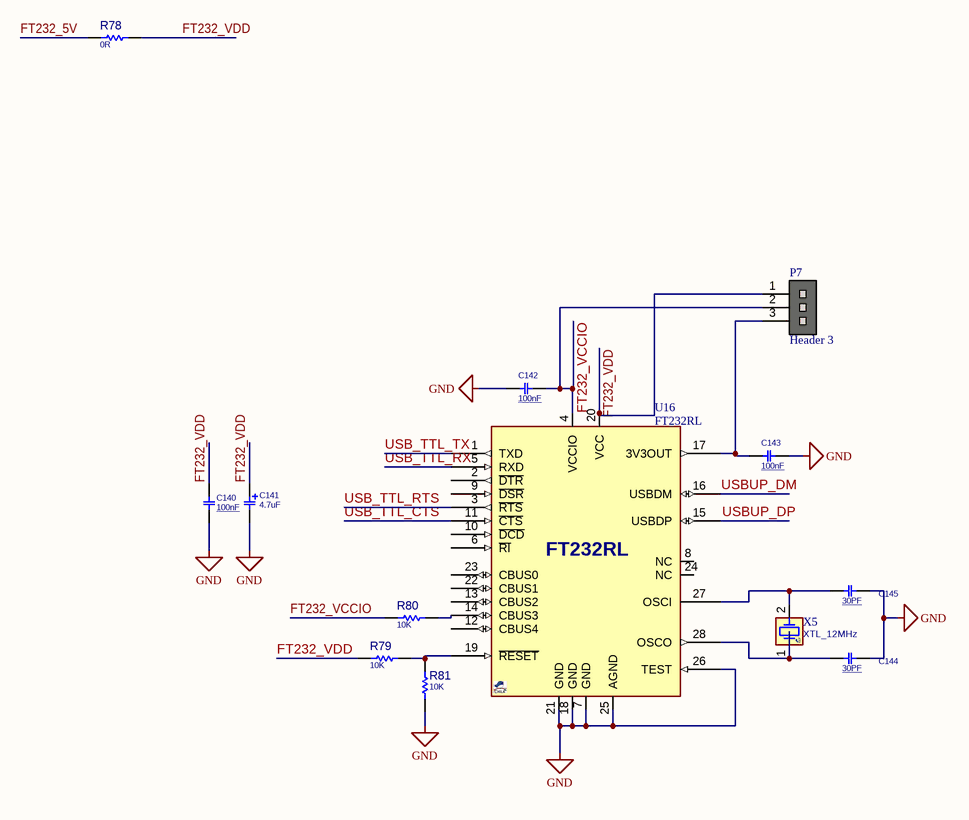
[diagram p23: USB_TTL.SchDoc]

### Parts
C140  100nF  [0603]
C141  4.7uF  [C_TN_3216]
C142  100nF  [0603]
C143  100nF  [0603]
C144  30PF  [C0805]
C145  30PF  [C0805]
P7  Header 3  [HDR 1X3]
R78  0R  [R0603]
R79  10K  [R0603]
R80  10K  [R0603]
R81  10K  [R0603]
U16  FT232RL  [SOG65_28_W]
X5  XTL_12MHz  [XTL_2_11X5]

### Nets
FT232_5V: R78.1  [project net Current_Measurement_1_in-]
GND: C140.2 C141.2 C142.1 C143.2 C144.2 C145.2 R81.2 U16.7(GND) U16.18(GND) U16.21(GND) U16.25(AGND) U16.26(TEST)
FT232_VCCIO: C142.2 P7.2 R80.2 U16.4(VCCIO)
FT232_VDD: C140.1 C141.1 P7.1 R78.2 R79.1 U16.20(VCC)
USB_TTL_CTS: U16.11(~{CTS})
USB_TTL_RTS: U16.3(~{RTS})
USB_TTL_RX: U16.5(RXD)
USB_TTL_TX: U16.1(TXD)
USBUP_DM: U16.16(USBDM)
USBUP_DP: U16.15(USBDP)
NetC143_1: C143.1 P7.3 U16.17(3V3OUT)
NetC144_1: C144.1 U16.28(OSCO) X5.1(OSC1)
NetC145_1: C145.1 U16.27(OSCI) X5.2(OSC2)
NetR79_2: R79.2 R81.1 U16.19(~{RESET})
NetR80_1: R80.1 U16.14(CBUS3)

Not connected (* = marked no-connect by the designer): U16 2(~{DTR}) 6(~{RI}) 8(NC) 9(~{DSR}) 10(~{DCD}) 12(CBUS4) 13(CBUS2) 22(CBUS1) 23(CBUS0) 24(NC)

### Notes on the sheet
- Drawn
- Name
- Date
- Drawing Title
- Checked
- Drawing No.
- Approved
- Size
- A4
- Ver.
- Rev.
- Sheet
- Of

### Library data of the parts
C140 C142 C143 = CAP_SMD_FILM_1u16v_1210: as C128-C134 on sheet FT2232HL_OUT; PRICE: 100= 36$; DESC: -; PARAM2: 16V; ASSEMBLY: ASSEMBLY; VALUE: 100nF
C141 = CAP_SMD_TAN_10uF_6.3V: as C135 on sheet FT2232HL_OUT; PRICE: 0.46$; VALUE: 4.7uF
C144 C145 = CAP_SMD_MLCC: as C137 on sheet FT2232HL_OUT; PARAM: C0G, 10%; PRICE: 100= 1.4$; DESC: -; MANF_P#: -; PARAM2: 50V; ASSEMBLY: ASSEMBLY; VALUE: 30PF
P7 = Header 3: Header, 3-Pin; ComponentLinkp-URL: https://www.smartw.ir/; DatasheetVersion: 2020
R78-R81 = RES_SMD_0603: as R63-R72 on sheet FT2232HL_OUT; MANF_P#: -; MANF: -; ASSEMBLY: ASSEMBLY; PRICE: 100= 0.5$
  R78: VALUE: 0R
  R79-R81: VALUE: 10K
U16 = FT232RL_SSOP28: USB-UART, Asynchronous Serial Data Transfer Chip, SSOP-28; MANF: FTDI; PARAM2: 3.3~5.25Vcc, 1.8~5.25VIO; MANF_P#: FT232RL; VALUE: FT232RL
X5 = XTL_2_HC49_8MHz_SMD: as X4 on sheet FT2232HL_OUT; PRICE: 0.3$; VALUE: XTL_12MHz

## Sheet On Board Terminals.SchDoc
size 297 x 209 mm; SheetNumber: 28; SheetTotal: 29
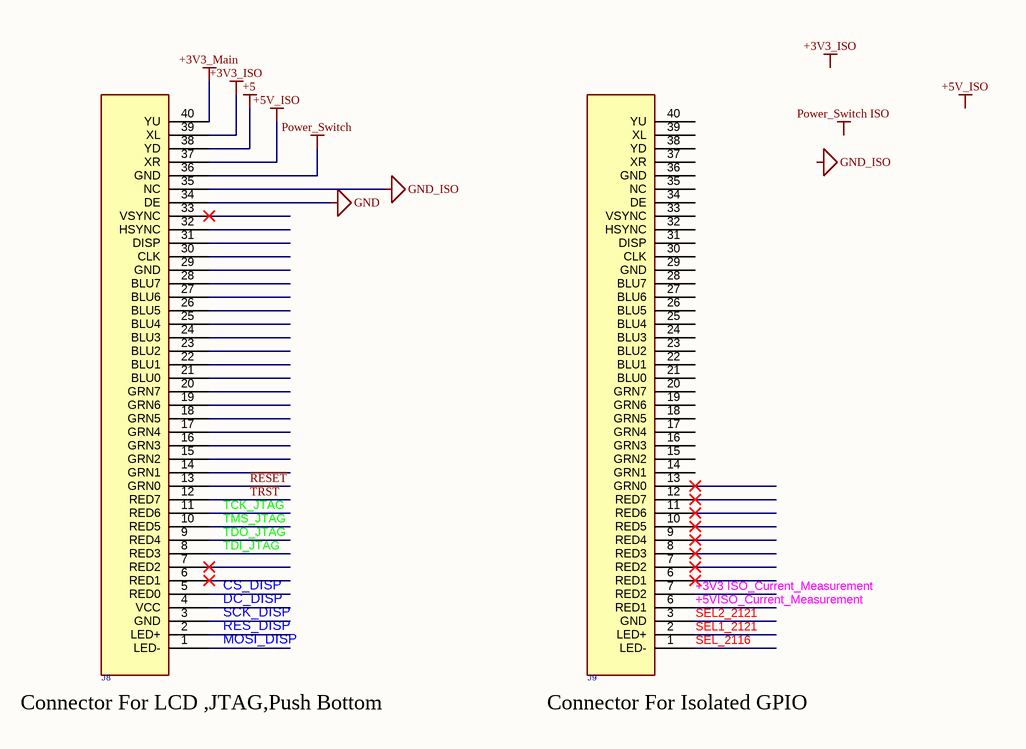
[diagram p24: On Board Terminals.SchDoc]

### Parts
J8  FPC50 40  [FPC50_40]  (value not drawn)
J9  FPC50 40  [FPC50_40]  (value not drawn)

### Nets
+3V3_ISO: J8.39(XL)  [project net Current_Measurement_4_in+]
+3V3_Main: J8.40(YU)  [project net Audio_VDD_3V3]
+5: J8.38(YD)  [project net Current_Measurement_1_in-]
+5V_ISO: J8.37(XR)  [project net Current_Measurement_2_in-]
GND: J8.34(DE)
GND_ISO: J8.35(NC)
Power_Switch: J8.36(GND)
+3V3 ISO_Current_Measurement: J9.7(RED2)
+5VISO_Current_Measurement: J9.6(RED1)
CS_DISP: J8.5(RED0)
DC_DISP: J8.4(VCC)
MOSI_DISP: J8.1(LED-)
~{RESET}: J8.13(GRN0)
RES_DISP: J8.2(LED+)
SCK_DISP: J8.3(GND)
SEL1_2121: J9.2(LED+)
SEL2_2121: J9.3(GND)
SEL_2116: J9.1(LED-)
~{TRST}: J8.12(RED7)
TCK_JTAG: J8.11(RED6)
TDI_JTAG: J8.8(RED3)
TDO_JTAG: J8.9(RED4)
TMS_JTAG: J8.10(RED5)

Not connected (* = marked no-connect by the designer): J8 6(RED1)* 7(RED2)* 14(GRN1) 15(GRN2) 16(GRN3) 17(GRN4) 18(GRN5) 19(GRN6) 20(GRN7) 21(BLU0) 22(BLU1) 23(BLU2) 24(BLU3) 25(BLU4) 26(BLU5) 27(BLU6) 28(BLU7) 29(GND) 30(CLK) 31(DISP) 32(HSYNC) 33(VSYNC)*; J9 8(RED3)* 9(RED4)* 10(RED5)* 11(RED6)* 12(RED7)* 13(GRN0)* 14(GRN1) 15(GRN2) 16(GRN3) 17(GRN4) 18(GRN5) 19(GRN6) 20(GRN7) 21(BLU0) 22(BLU1) 23(BLU2) 24(BLU3) 25(BLU4) 26(BLU5) 27(BLU6) 28(BLU7) 29(GND) 30(CLK) 31(DISP) 32(HSYNC) 33(VSYNC) 34(DE) 35(NC) 36(GND) 37(XR) 38(YD) 39(XL) 40(YU)

### Notes on the sheet
- (near J8) Connector For LCD ,JTAG,Push Bottom
- (near J9) Connector For Isolated GPIO
- Labels drawn without touching a wire or pin: +3V3_ISO, +5V_ISO, GND_ISO, Power_Switch ISO
- Drawn
- Name
- Date
- Drawing Title
- Checked
- Drawing No.
- Approved
- Size
- A4
- Ver.
- Rev.
- Sheet
- Of

### Library data of the parts
J8 J9 = FPC50 40: CONN, FPC, 0.50mm pitch, RightAngle, Bot. Contact; ComponentLink1Description: Website Smart World; ComponentLink1URL: https://www.smartw.ir/; ComponentLink2Description: Telegram; ComponentLink2URL: https://t.me/altium_smartw; ComponentLink3Description: Instagram; ComponentLink3URL: https://Instagram.com/smartgw.ir; DatasheetVersion: 2021

## Sheet screw and Hole.SchDoc
size 297 x 209 mm; SheetNumber: 29; SheetTotal: 29
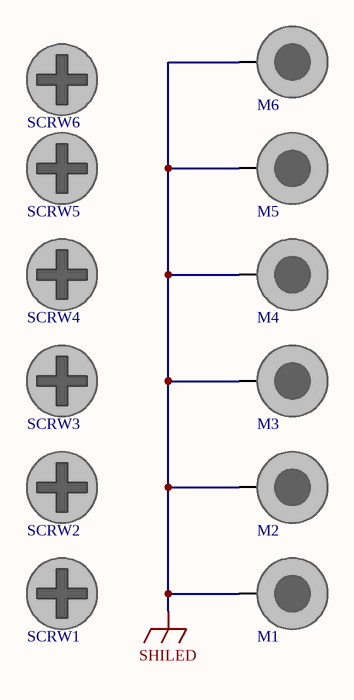
[diagram p25: screw and Hole.SchDoc]

### Parts
M1  DNP/MH  [SCMH_M3]  (value not drawn)  (no BOM)
M2  DNP/MH  [SCMH_M3]  (value not drawn)  (no BOM)
M3  DNP/MH  [SCMH_M3]  (value not drawn)  (no BOM)
M4  DNP/MH  [SCMH_M3]  (value not drawn)  (no BOM)
M5  DNP/MH  [SCMH_M3]  (value not drawn)  (no BOM)
M6  DNP/MH  [SCMH_M3]  (value not drawn)  (no BOM)
SCRW1  SCREW  [SCRW_PANH_PHLIPS_M3X5]  (value not drawn)
SCRW2  SCREW  [SCRW_PANH_PHLIPS_M3X5]  (value not drawn)
SCRW3  SCREW  [SCRW_PANH_PHLIPS_M3X5]  (value not drawn)
SCRW4  SCREW  [SCRW_PANH_PHLIPS_M3X5]  (value not drawn)
SCRW5  SCREW  [SCRW_PANH_PHLIPS_M3X5]  (value not drawn)
SCRW6  SCREW  [SCRW_PANH_PHLIPS_M3X5]  (value not drawn)

### Nets
SHILED: M1.1 M2.1 M3.1 M4.1 M5.1 M6.1

### Notes on the sheet
- Drawn
- Name
- Date
- Drawing Title
- Checked
- Drawing No.
- Approved
- Size
- A4
- Ver.
- Rev.
- Sheet
- Of

### Library data of the parts
M1-M6 = SCMH_M3: SCREW mouting, M3, 3.0mm diameter and 6.0mm PanHead; ASSEMBLY: DNP; VALUE: DNP/MH
SCRW1-SCRW6 = SCRW_PANH_PHLIPS_M3X5: SCREW, M3, 3.0mm diameter and 6.0mm PanHead; ASSEMBLY: DNP; VALUE: SCREW

## Nets that join several sheets
+1V8 ISO: Main Power (C1.1 D3.1 IC1.2), Power Switch (C31.1 IC10.6)
+5V: BIT(Built in Test) (C75.2 FL4.5), Power Switch (C22.1 IC7.2)
AGND: Terminals (24 pins), Audio Codec (9 pins)
Audio_VDD_1V8: Main Power (C8.1 D5.1 IC3.2), Power Switch (C30.1 IC9.6), Audio Codec (JP6.1)
Audio_VDD_3V3: Main Power (C5.1 D2.1 IC2.3 R1.2), BIT(Built in Test) (R39.1), Test Points (TP3.1), Power Switch (C25.1 IC7.7 R14.2 R15.2), Level Shifting (5 pins), Isolators (8 pins), SD CARD  (C146.2 R87.1 U17.1), MCU Sup (R91.2), FT2232HL_IN (R51.1), FT2232HL_OUT (R63.1), On Board Terminals (J8.40)
Current_Measurement_1_in-: Main Power (7 pins), AUX Power (C18.2 L3.1), BIT(Built in Test) (C71.2 FL2.5 R36.2), Test Points (TP4.1), MCU GPIO (U5.2), Sync In (U6.5 U7.5 U8.5), Sync Out (U9.5 U10.5 U11.5), USB_TTL (R78.1), On Board Terminals (J8.38)
Current_Measurement_2_in-: Main Power (C9.1 D4.2 IC4.1 R4.2), BIT(Built in Test) (5 pins), Test Points (TP1.1), Power Switch (C23.1 IC8.2), Display  (IC13.14 IC14.14 IC15.14), On Board Terminals (J8.37)
Current_Measurement_4_in+: Main Power (5 pins), BIT(Built in Test) (R35.2), Test Points (TP2.1), Power Switch (C27.1 IC8.7 R16.2 R17.2), Level Shifting (19 pins), Isolators (8 pins), On Board Terminals (J8.39)
GND: Terminals (13 pins), Main Power (10 pins), AUX Power (C18.1 C20.1), MCU 1 (29 pins), USB HUB (21 pins), BIT(Built in Test) (C71.1 C75.1 FL2.2), RS232 (6 pins), RS485 (8 pins), Power Switch (11 pins), Buffers (IC16.7 IC17.7), Mode Switch (IC23.5 IC23.6 IC24.5 IC24.6), Level Shifting (9 pins), Isolators (12 pins), Audio Codec (7 pins), SD CARD  (5 pins), MCU GPIO (U5.11), MCU Sup (19 pins), Sync In (R47.2 U6.3 U7.3 U8.3), Sync Out (U9.3 U10.3 U11.3), FT2232HL_IN (32 pins), FT2232HL_OUT (28 pins), USB_TTL (12 pins), On Board Terminals (J8.34)
GND1: Terminals (J7.2 J7.3), Main Power (6 pins), AUX Power (C19.2 D9.2), Power Switch (C21.1 R6.1)
GND_ISO: Terminals (26 pins), Main Power (10 pins), BIT(Built in Test) (5 pins), Power Switch (11 pins), Display  (IC13.7 IC14.7 IC15.7), Level Shifting (8 pins), Isolators (12 pins), On Board Terminals (J8.35)
GND_SER_232: Terminals (P4.5), RS232 (C77.1 C81.2 U4.11)
GND_SER_485: Terminals (P2.1), RS485 (7 pins)
MCU2_SUP_3V3ISO: Main Power (C15.1 D8.1 IC6.2), MCU Sup (13 pins)
Power_Switch: Terminals (P1.14), Power Switch (IC9.2 IC9.7), Level Shifting (6 pins), MCU GPIO (U5.19), On Board Terminals (J8.36)
Power_Switch ISO: Terminals (P3.14 P5.14), Power Switch (IC10.2 IC10.7)
Serial_VDD: AUX Power (C20.2 L3.2), Buffers (IC16.14 IC17.14), Mode Switch (IC23.16 IC24.16)
SHILED: Terminals (18 pins), screw and Hole (6 pins)
50_OHM: Terminals (J5.1), Mode Switch (IC23.8), Sync In (U6.2)
50_OHM_CN: Mode Switch (IC23.9), Sync In (R47.1)
+3V3 ISO_Current_Measurement: BIT(Built in Test) (FL1.1), On Board Terminals (J9.7)
+3V3 Main_Current_Measurement: MCU 1 (U3.34), BIT(Built in Test) (FL4.1)
+5_Current_Measurement: MCU 1 (U3.32), BIT(Built in Test) (FL2.1)
+5VISO_Current_Measurement: BIT(Built in Test) (FL3.1), On Board Terminals (J9.6)
+Vin: Terminals (J7.1), Main Power (D1.2 D6.2), AUX Power (C19.1 R5.2), Power Switch (R7.1)
~{POWEREN} _FT IN: Level Shifting (IC25.22 IC27.22 IC29.22), FT2232HL_IN (D11.2 R54.2 U12.60)
A_485: Terminals (P2.4), RS485 (IC12.18)
B_485: Terminals (P2.5), RS485 (IC12.17)
BD1(SDA,RX): Mode Switch (IC24.3), FT2232HL_IN (R57.2 U12.39)
BD2(MISO_SPI,TDO_JTAG): Mode Switch (IC24.18), FT2232HL_OUT (R69.2 U14.40)
BD3(CS_SPI , TMS_JTAG): Buffers (IC16.9 IC16.11), FT2232HL_OUT (R70.2 U14.41)
CS_DISP: MCU 1 (U3.69), On Board Terminals (J8.5)
CS_SPI_1: Buffers (IC16.8), Level Shifting (IC27.7)
Current_Measurement_1_in+: Main Power (R3.1 U1.3), BIT(Built in Test) (R34.1)
Current_Measurement_2_in+: Main Power (5 pins), BIT(Built in Test) (R37.1)
Current_Measurement_3_in-: Main Power (R1.1), BIT(Built in Test) (R40.2)
DC_DISP: MCU 1 (U3.68), On Board Terminals (J8.4)
FT2232_East_DM: USB HUB (IC11.3), FT2232HL_OUT (D15.2 R75.1)
FT2232_East_DP: USB HUB (IC11.4), FT2232HL_OUT (D16.2 R74.1)
FT2232_West_DM: USB HUB (IC11.1), FT2232HL_IN (D12.1 R60.1)
FT2232_West_DP: USB HUB (IC11.2), FT2232HL_IN (D13.1 R59.1)
GPI0_IN: Terminals (P5.15), Level Shifting (IC28.21 RA13.1)
GPI0_IN_Buff: Level Shifting (RA11.1), Isolators (IC20.3)
GPI1_IN: Terminals (P5.16), Level Shifting (IC28.20 RA14.2)
GPI1_IN_Buff: Level Shifting (RA12.2), Isolators (IC20.4)
GPI1_OUT_Buff: Isolators (IC20.13), FT2232HL_IN (U12.17)
GPI2_IN: Terminals (P5.17), Level Shifting (IC28.19 RA14.3)
GPI2_IN_Buff: Level Shifting (RA12.3), Isolators (IC20.5)
GPI2_OUT_Buff: Isolators (IC20.12), FT2232HL_IN (U12.18)
GPI3_IN: Terminals (P5.18), Level Shifting (IC28.18 RA14.4)
GPI3_IN_Buff: Level Shifting (RA12.4), Isolators (IC20.6)
GPI3_OUT_Buff: Isolators (IC20.11), FT2232HL_IN (U12.19)
GPI4_IN: Terminals (P5.19), Level Shifting (IC28.17 RA12.1)
GPI4_IN_Buff: Level Shifting (RA10.1), Isolators (IC18.3)
GPI5_IN: Terminals (P5.20), Level Shifting (IC28.16 RA13.2)
GPI5_IN_Buff: Level Shifting (RA11.2), Isolators (IC18.4)
GPI5_OUT_Buff: Isolators (IC18.13), FT2232HL_IN (U12.22)
GPI6_IN: Terminals (P5.21), Level Shifting (IC28.15 RA13.3)
GPI6_IN_Buff: Level Shifting (RA11.3), Isolators (IC18.5)
GPI6_OUT_Buff: Isolators (IC18.12), FT2232HL_IN (U12.23)
GPI7_IN: Terminals (P5.22), Level Shifting (IC28.14 RA13.4)
GPI7_IN_Buff: Level Shifting (RA11.4), Isolators (IC18.6)
GPI7_OUT_Buff: Isolators (IC18.11), FT2232HL_IN (U12.24)
GPO0_IN: Isolators (IC19.3), FT2232HL_OUT (U14.16)
GPO0_OUT: Level Shifting (1.8 IC26.3), Isolators (IC19.14)
GPO0_OUT_Buff: Terminals (P3.15), Level Shifting (RA7.8)
GPO1_IN: Isolators (IC19.4), FT2232HL_OUT (U14.17)
GPO1_OUT: Level Shifting (IC26.4 RA4.7), Isolators (IC19.13)
GPO1_OUT_Buff: Terminals (P3.16), Level Shifting (RA8.7)
GPO2_IN: Isolators (IC19.5), FT2232HL_OUT (U14.18)
GPO2_OUT: Level Shifting (IC26.5 RA4.6), Isolators (IC19.12)
GPO2_OUT_Buff: Terminals (P3.17), Level Shifting (RA8.6)
GPO3_IN: Isolators (IC19.6), FT2232HL_OUT (U14.19)
GPO3_OUT: Level Shifting (IC26.6 RA4.5), Isolators (IC19.11)
GPO3_OUT_Buff: Terminals (P3.18), Level Shifting (RA8.5)
GPO4_IN: Isolators (IC21.3), FT2232HL_OUT (U14.21)
GPO4_OUT_Buff: Terminals (P3.19), Level Shifting (RA6.8)
GPO5_IN: Isolators (IC21.4), FT2232HL_OUT (U14.22)
GPO5_OUT: Level Shifting (IC26.8 RA3.7), Isolators (IC21.13)
GPO5_OUT_Buff: Terminals (P3.20), Level Shifting (RA7.7)
GPO6_IN: Isolators (IC21.5), FT2232HL_OUT (U14.23)
GPO6_OUT: Level Shifting (IC26.9 RA3.6), Isolators (IC21.12)
GPO6_OUT_Buff: Terminals (P3.21), Level Shifting (RA7.6)
GPO7_IN: Isolators (IC21.6), FT2232HL_OUT (U14.24)
GPO7_OUT: Level Shifting (IC26.10 RA3.5), Isolators (IC21.11)
GPO7_OUT_Buff: Terminals (P3.22), Level Shifting (RA7.5)
GPO_MCU_1: MCU 1 (U3.55), MCU GPIO (U5.1)
GPO_MCU_2: MCU 1 (U3.56), MCU GPIO (U5.3)
GPO_MCU_3: MCU 1 (U3.57), MCU GPIO (U5.4)
GPO_MCU_4: MCU 1 (U3.58), MCU GPIO (U5.5)
GPO_MCU_5: MCU 1 (U3.59), MCU GPIO (U5.6)
GPO_MCU_6: MCU 1 (U3.60), MCU GPIO (U5.7)
GPO_MCU_7: MCU 1 (U3.61), MCU GPIO (U5.8)
GPO_MCU_8: MCU 1 (U3.62), MCU GPIO (U5.9)
GPO_MCU_Buffer_1: Terminals (P1.6), MCU GPIO (U5.20)
GPO_MCU_Buffer_2: Terminals (P1.7), MCU GPIO (U5.18)
GPO_MCU_Buffer_3: Terminals (P1.8), MCU GPIO (U5.17)
GPO_MCU_Buffer_4: Terminals (P1.9), MCU GPIO (U5.16)
GPO_MCU_Buffer_5: Terminals (P1.10), MCU GPIO (U5.15)
GPO_MCU_Buffer_6: Terminals (P1.11), MCU GPIO (U5.14)
GPO_MCU_Buffer_7: Terminals (P1.12), MCU GPIO (U5.13)
GPO_MCU_Buffer_8: Terminals (P1.13), MCU GPIO (U5.12)
MCU_GPIO_Select: MCU 1 (U3.81), MCU GPIO (U5.10)
MISO_SPI: Terminals (P1.3), Level Shifting (IC25.19 RA6.3)
MODE1: Mode Switch (IC24.1), MCU Sup (U18.10)
MODE2: Mode Switch (IC24.10), MCU Sup (U18.11)
MODE3: Mode Switch (IC24.11), MCU Sup (U18.12)
MODE4: Mode Switch (IC24.20), MCU Sup (U18.13)
MODE5: Mode Switch (IC23.1), MCU Sup (U18.14)
MODE6: Mode Switch (IC23.10), MCU Sup (U18.15)
MOSI_DISP: MCU 1 (U3.31), On Board Terminals (J8.1)
MOSI_SPI: Terminals (P1.2), Level Shifting (RA10.5)
MOSI_SPI_1: Buffers (IC16.5 IC16.13), FT2232HL_OUT (U14.39)
MOSI_SPI_2: Buffers (IC16.6), Level Shifting (IC27.6)
ON/OFF Remote: Main Power (U1.6 U2.6), Power Switch (R7.2 SW1.3)
~{RD}: Terminals (P3.24), FT2232HL_OUT (U14.53)
~{RESET}: Level Shifting (RA16.6), On Board Terminals (J8.13)
~{RESET}_FT: Level Shifting (IC29.4), FT2232HL_OUT (R64.2 U14.44)
~{RXF}: Terminals (P3.25), FT2232HL_OUT (U14.48)
RES_DISP: MCU 1 (C49.1 R21.1 U3.14 U3.67), On Board Terminals (J8.2)
RX_232: Terminals (P4.2), RS232 (U4.15)
RX_ADM2587: RS485 (R44.1), Mode Switch (IC24.9)
RX_ADM3251: RS232 (R42.1), Mode Switch (IC24.7)
RX_TTL_2: Mode Switch (IC24.8), Level Shifting (IC25.21 RA1.1 RA5.1)
SCK_DISP: MCU 1 (U3.29), On Board Terminals (J8.3)
SCL_I2C: Terminals (P1.5), Level Shifting (RA9.8 RA10.6)
SCL_I2C_1: Buffers (IC17.1 IC17.3 IC17.5), FT2232HL_IN (R56.2 U12.38)
SCL_I2C_2: Buffers (IC17.6), Level Shifting (IC27.3)
SDA_I2C: Terminals (P1.4), Level Shifting (IC25.20 RA6.2 RA10.7)
SDA_I2C_OUT: Mode Switch (IC24.13), FT2232HL_IN (U12.40)
SDA_OUT_1: Mode Switch (IC24.4), Level Shifting (IC27.4)
SEL1_2121: Power Switch (IC7.5), On Board Terminals (J9.2)
SEL1_2121_ISO: Power Switch (IC8.5), MCU Sup (U18.29)
SEL2_2121: Power Switch (IC7.4), On Board Terminals (J9.3)
SEL2_2121_ISO: Power Switch (IC8.4), MCU Sup (U18.30)
SEL_2116: Power Switch (IC9.4), On Board Terminals (J9.1)
SEL_2116_ISO: Power Switch (IC10.4), MCU Sup (U18.31)
SIWU_IN: Terminals (P5.23), FT2232HL_IN (U12.55)
SIWU_OUT: Terminals (P3.23), FT2232HL_OUT (U14.55)
SYNC_IN(ETR_TIM1): MCU 1 (U3.37), Sync In (U8.4)
SYNC_IN(TIM1_CH2): MCU 1 (U3.41), Sync In (U7.4)
SYNC_OUT: Terminals (J6.1), Sync Out (R48.2 R49.2 R50.2)
SYNC_OUT_MCU: MCU 1 (U3.39), Sync Out (U9.2 U10.2 U11.2)
~{TRST}: Level Shifting (RA16.7), On Board Terminals (J8.12)
~{TRST}_MCU: MCU 1 (U3.90), Level Shifting (IC29.3), FT2232HL_OUT (R65.2 U14.43)
~{TXE}: Terminals (P5.25), FT2232HL_IN (U12.52)
TCK_JTAG_1: Buffers (IC16.1 IC16.3), FT2232HL_OUT (R68.2 U14.38)
TCK_JTAG_2: MCU 1 (U3.76), Buffers (IC16.2), Level Shifting (IC27.8)
TCK_SPI_2: Buffers (IC16.4), Level Shifting (IC27.5)
TDI_JTAG_2: MCU 1 (U3.77), Buffers (IC16.12)
TDO_JTAG: Level Shifting (IC25.18 RA6.4), On Board Terminals (J8.9)
TDO_JTAG_EXT: Mode Switch (IC23.4), Level Shifting (RA2.4)
TDO_JTAG_MCU: MCU 1 (U3.89), Mode Switch (IC23.2), Level Shifting (IC27.9)
TMS_JTAG: Level Shifting (RA9.5), On Board Terminals (J8.10)
TMS_JTAG_MCU: MCU 1 (U3.72), Buffers (IC16.10), Level Shifting (IC27.10)
TX_232: Terminals (P4.3), RS232 (U4.16)
TX_ADM2582: RS485 (R43.1), Buffers (IC17.4)
TX_ADM3251: RS232 (R41.1), Buffers (IC17.2)
USB_TTL_CTS: MCU 1 (U3.53), USB_TTL (U16.11)
USB_TTL_RTS: MCU 1 (U3.54), USB_TTL (U16.3)
USB_TTL_RX: MCU 1 (U3.22), USB_TTL (U16.5)
USB_TTL_TX: MCU 1 (U3.23), USB_TTL (U16.1)
USBUP_DM: Terminals (PUSB1.2), USB HUB (IC11.30), USB_TTL (U16.16)
USBUP_DP: Terminals (PUSB1.3), USB HUB (IC11.31), USB_TTL (U16.15)
VBUS_UP: Terminals (FB1.2), FT2232HL_IN (R53.1), FT2232HL_OUT (R67.1)
VCAP: MCU 1 (6 pins), MCU Sup (C158.1 C159.1)
VIN_1.8vISO: Main Power (C7.1 D3.2 IC1.3), Power Switch (C29.1 IC8.1 IC8.8 IC10.3)
VREF+: MCU 1 (C43.1 C44.1 R19.1 U3.20), MCU Sup (C156.1 C157.1)
~{WR}: Terminals (P5.24), FT2232HL_IN (U12.54)
Y_485: Terminals (P2.9), RS485 (IC12.13)
Z_485: Terminals (P2.8), RS485 (IC12.15)